# Altium project SuperBot.PrjPcb
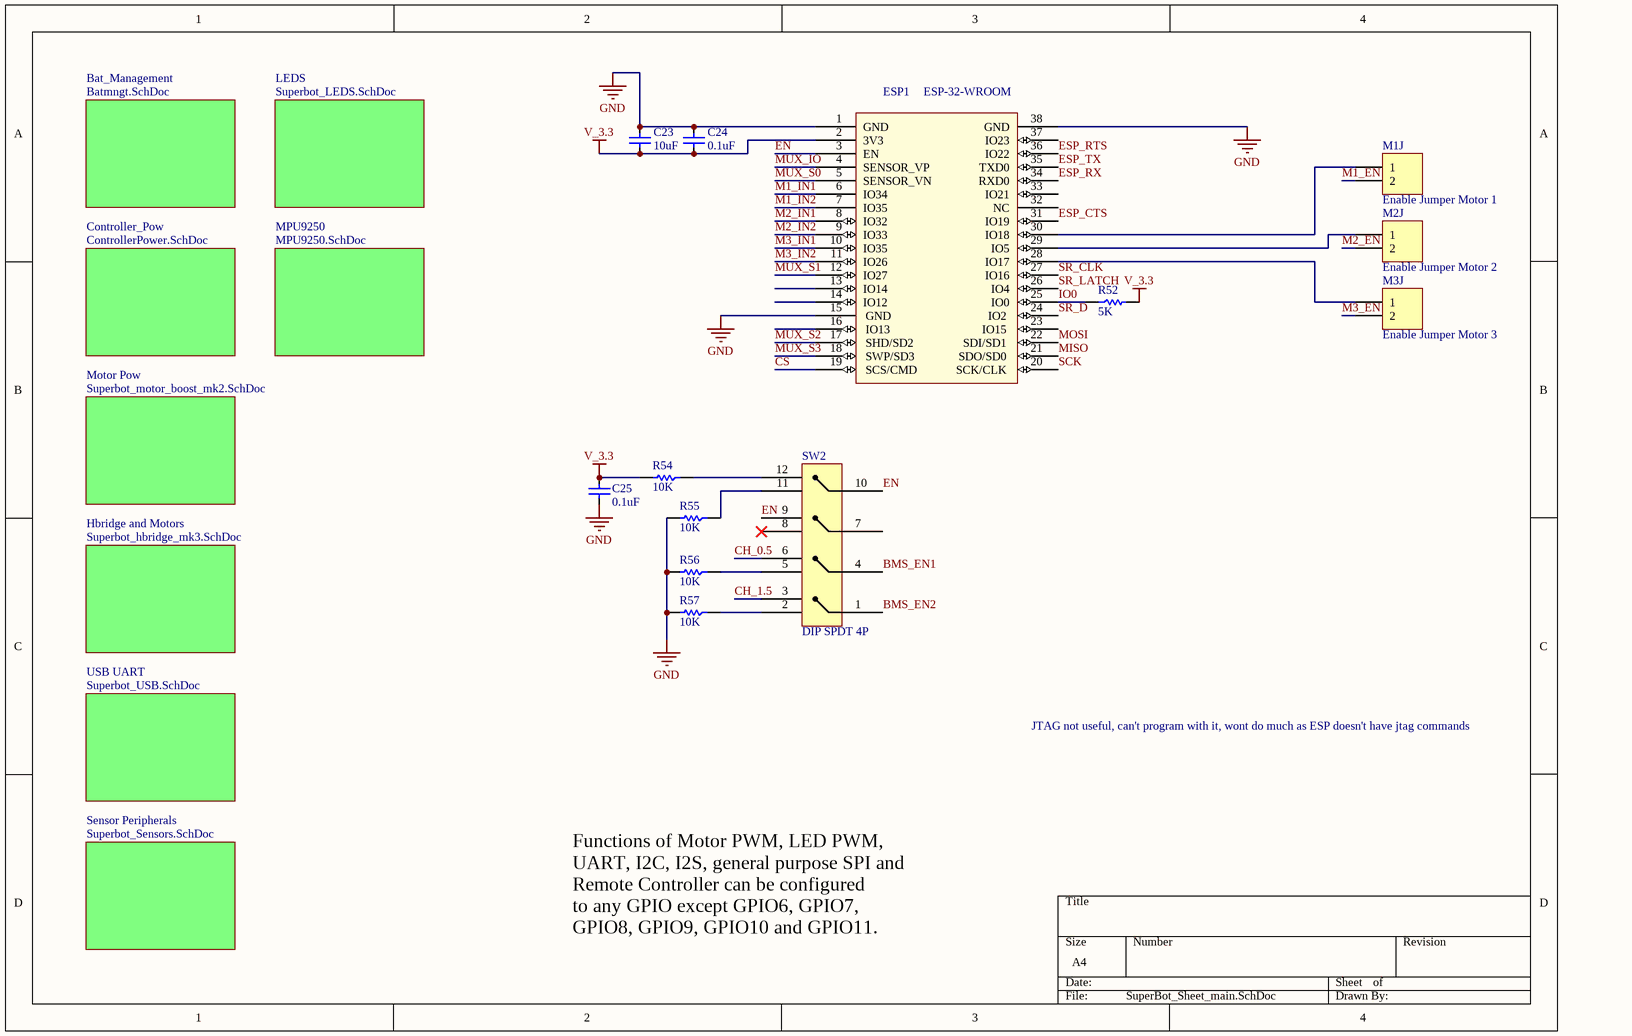
[diagram p0: SuperBot_Sheet_main.SchDoc]
9 sheets, 122 parts. Net scope: global (net labels, ports and power ports of the same name join across sheets).
Board file: SuperBot_Pcb.PcbDoc
Sheets:
  SuperBot_Sheet_main.SchDoc
    Bat_Management = Batmngt.SchDoc
    Controller_Pow = ControllerPower.SchDoc
    Hbridge and Motors = Superbot_hbridge_mk3.SchDoc
    Motor Pow = Superbot_motor_boost_mk2.SchDoc
    USB UART = Superbot_USB.SchDoc
    Sensor Peripherals = SuperBot_Sensors.SchDoc
    LEDS = Superbot_LEDS.SchDoc
    MPU9250 = MPU9250.SchDoc

## Sheet SuperBot_Sheet_main.SchDoc
size A4

### Parts
C23  10uF  [CAP0603R]
C24  0.1uF  [CAP0603R]
C25  0.1uF  [CAP0603R]
ESP1  ESP-32-WROOM  [ESP-32-WROOM]
M1J  Enable Jumper Motor 1  [HDR1X2]
M2J  Enable Jumper Motor 2  [HDR1X2]
M3J  Enable Jumper Motor 3  [HDR1X2]
R52  5K  [RES0603R]
R54  10K  [RES0603R]
R55  10K  [RES0603R]
R56  10K  [RES0603R]
R57  10K  [RES0603R]
SW2  DIP SPDT 4P  [DIP SPDT 4P]

### Sub-sheets
Bat_Management = Batmngt.SchDoc: no entries
Controller_Pow = ControllerPower.SchDoc: no entries
Hbridge and Motors = Superbot_hbridge_mk3.SchDoc: no entries
LEDS = Superbot_LEDS.SchDoc: no entries
Motor Pow = Superbot_motor_boost_mk2.SchDoc: no entries
MPU9250 = MPU9250.SchDoc: no entries
Sensor Peripherals = Superbot_Sensors.SchDoc: no entries
USB UART = Superbot_USB.SchDoc: no entries

### Nets
GND: C23.1 C24.1 C25.2 ESP1.1(GND) ESP1.15(GND) ESP1.38(GND) R55.2 R56.2 R57.2
V_3.3: C23.2 C24.2 C25.1 ESP1.2(3V3) R52.2 R54.2
BMS_EN1: SW2.4
BMS_EN2: SW2.1
CH_0.5: SW2.6
CH_1.5: SW2.3
CS: ESP1.19(SCS/CMD)
EN: ESP1.3(EN) SW2.9 SW2.10
ESP_CTS: ESP1.31(IO19)
ESP_RTS: ESP1.36(IO22)
ESP_RX: ESP1.34(RXD0)
ESP_TX: ESP1.35(TXD0)
IO0: ESP1.25(IO0) R52.1
M1_EN: M1J.2
M1_IN1: ESP1.6(IO34)
M1_IN2: ESP1.7(IO35)
M2_EN: M2J.2
M2_IN1: ESP1.8(IO32)
M2_IN2: ESP1.9(IO33)
M3_EN: M3J.2
M3_IN1: ESP1.10(IO35)
M3_IN2: ESP1.11(IO26)
MISO: ESP1.21(SDO/SD0)
MOSI: ESP1.22(SDI/SD1)
MUX_IO: ESP1.4(SENSOR_VP)
MUX_S0: ESP1.5(SENSOR_VN)
MUX_S1: ESP1.12(IO27)
MUX_S2: ESP1.17(SHD/SD2)
MUX_S3: ESP1.18(SWP/SD3)
SCK: ESP1.20(SCK/CLK)
SR_CLK: ESP1.27(IO16)
SR_D: ESP1.24(IO2)
SR_LATCH: ESP1.26(IO4)
NetESP1_28: ESP1.28(IO17) M3J.1
NetESP1_29: ESP1.29(IO5) M2J.1
NetESP1_30: ESP1.30(IO18) M1J.1
NetR54_1: R54.1 SW2.12
NetR55_1: R55.1 SW2.11
NetR56_1: R56.1 SW2.5
NetR57_1: R57.1 SW2.2

Not connected (* = marked no-connect by the designer): ESP1 13(IO14) 14(IO12) 16(IO13) 23(IO15) 32(NC) 33(IO21) 37(IO23); SW2 7 8*

### Notes on the sheet
- JTAG not useful, can't program with it, wont do much as ESP doesn't have jtag commands
- Functions of Motor PWM, LED PWM, UART, I2C, I2S, general purpose SPI and Remote Controller can be configured
  to any GPIO except GPIO6, GPIO7, GPIO8, GPIO9, GPIO10 and GPIO11.

### Library data of the parts
C23-C25 = C: Capacitor; Manufacturer: Microchip Technology; Manufacturer Part Num: MIC5378YC5-TR; Class I: Passive; Revision: July-2002: Re-released for DXP Platform.; Supplier 1: Digikey; Supplier Part Number 1: *; Supplier Part Number 1: 1611-MIC5378YC5-CT-ND
  C23: Value: 10uF
  C24 C25: Value: 0.1uF
ESP1 = ESP-32-WROOM: ESP-32-WROOM, WIFI + BT
M1J M2J M3J = Header 2: Header, 2-Pin; LatestRevisionDate: 17-Jul-2002; LatestRevisionNote: Re-released for DXP Platform.; Publisher: Altium Limited
R52 R54-R57 = R: Resistor; Supplier 1: Digikey; Supplier Part Number 1: *
  R52: Value: 5K
  R54-R57: Value: 10K

## Sheet Batmngt.SchDoc
size A4
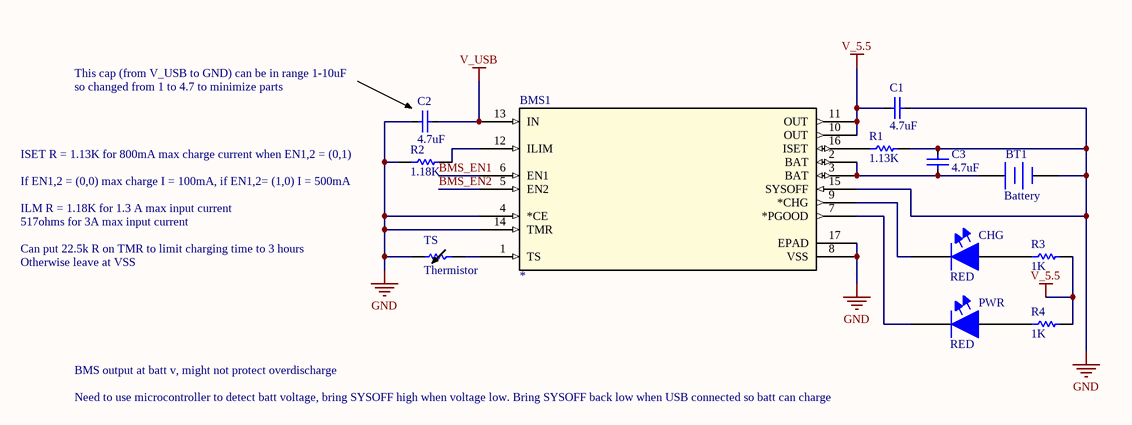
[diagram p1: Batmngt.SchDoc]

### Parts
BMS1  *  [RGT16_1P7X1P7]
BT1  Battery  [BAT-2]
C1  4.7uF  [CAP0603R]
C2  4.7uF  [CAP0603R]
C3  4.7uF  [CAP0603R]
CHG  RED  [0603_LED]
PWR  RED  [0603_LED]
R1  1.13K  [RES0603R]
R2  1.18K  [RES0603R]
R3  1K  [RES0603R]
R4  1K  [RES0603R]
TS  Thermistor  [RES0603R]

### Nets
GND: BMS1.4(*CE) BMS1.8(VSS) BMS1.14(TMR) BMS1.15(SYSOFF) BMS1.17(EPAD) BT1.2(-) C1.2 C2.1 C3.1 R1.2 R2.1 TS.2
V_5.5: BMS1.10(OUT) BMS1.11(OUT) C1.1 R3.2 R4.2
V_USB: BMS1.13(IN) C2.2
BMS_EN1: BMS1.6(EN1)
BMS_EN2: BMS1.5(EN2)
NetBMS1_1: BMS1.1(TS) TS.1
NetBMS1_2: BMS1.2(BAT) BMS1.3(BAT) BT1.1(+) C3.2
NetBMS1_7: BMS1.7(*PGOOD) PWR.K(CATHODE)
NetBMS1_9: BMS1.9(*CHG) CHG.K(CATHODE)
NetBMS1_12: BMS1.12(ILIM) R2.2
NetBMS1_16: BMS1.16(ISET) R1.1
NetCHG_A: CHG.A(ANODE) R3.1
NetPWR_A: PWR.A(ANODE) R4.1

### Notes on the sheet
- (near C2) This cap (from V_USB to GND) can be in range 1-10uF
- so changed from 1 to 4.7 to minimize parts
- (near R2) ISET R = 1.13K for 800mA max charge current when EN1,2 = (0,1)
- (near R2) If EN1,2 = (0,0) max charge I = 100mA, if EN1,2= (1,0) I = 500mA
- ILM R = 1.18K for 1.3 A max input current
- Can put 22.5k R on TMR to limit charging time to 3 hours
- Otherwise leave at VSS
- 517ohms for 3A max input current
- BMS output at batt v, might not protect overdischarge
- Need to use microcontroller to detect batt voltage, bring SYSOFF high when voltage low. Bring SYSOFF back low when USB connected so batt can charge

### Library data of the parts
BMS1 = BQ24079RGTR: Imported; Manufacturer: Texas Instruments; Built_By: EMA_UL_Team; C: Copyright (C) 2015 Accelerated Designs. All rights reserved; Vendor: Vendor; Manufacturer_Part_Number: BQ24079RGTR; Value: Value; Type: Type; RefDes: RefDes
BT1 = Battery: Multicell Battery; Published: 24-Mar-1999; LatestRevisionDate: 17-Jul-2002; LatestRevisionNote: Re-released for DXP Platform.; PackageReference: BAT-2; Publisher: Altium Limited; PackageDescription: Battery; 2 Leads
C1-C3 = C: as C23 on sheet SuperBot_Sheet_main; Revision: July-2002: Re-released for DXP Platform.; Supplier 1: Digikey; Supplier Part Number 1: *; Supplier Part Number 1: 1611-MIC5378YC5-CT-ND; Value: 4.7uF
CHG PWR = LED: Color: RED; Supplier 1: Digikey
R1-R4 = R: Resistor; Supplier 1: Digikey; Supplier Part Number 1: *
  R1: Value: 1.13K
  R2: Value: 1.18K
  R3 R4: Value: 1K

## Sheet ControllerPower.SchDoc
size A4
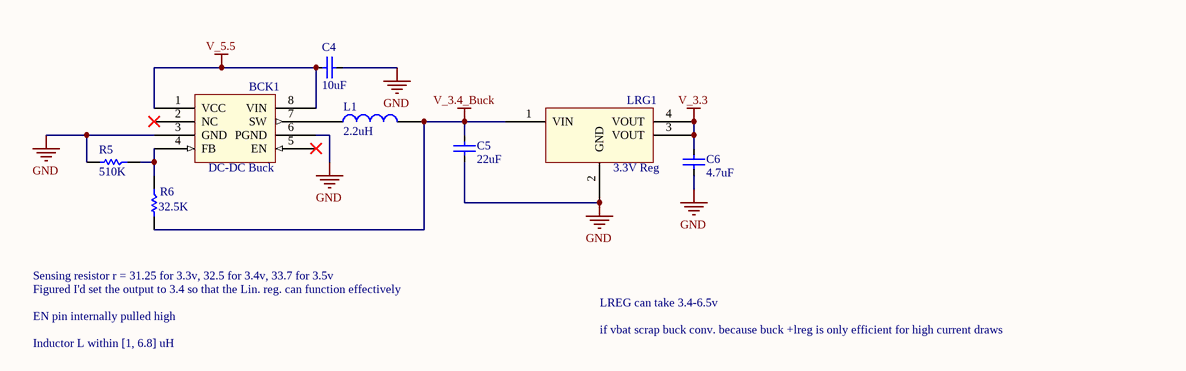
[diagram p2: ControllerPower.SchDoc]

### Parts
BCK1  DC-DC Buck  [SOP8_AP3435]
C4  10uF  [CAP0603R]
C5  22uF  [CAP0805R]
C6  4.7uF  [CAP0603R]
L1  2.2uH  [744031004]
LRG1  3.3V Reg  [SOT223_AP2114]
R5  510K  [RES0603R]
R6  32.5K  [RES0603R]

### Nets
GND: BCK1.3(GND) BCK1.6(PGND) C4.1 C5.2 C6.2 LRG1.2(GND) R5.2
V_3.3: C6.1 LRG1.3(VOUT) LRG1.4(VOUT)
V_3.4_Buck: C5.1 L1.2 LRG1.1(VIN) R6.2
V_5.5: BCK1.1(VCC) BCK1.8(VIN) C4.2
NetBCK1_4: BCK1.4(FB) R5.1 R6.1
NetBCK1_7: BCK1.7(SW) L1.1

Not connected (* = marked no-connect by the designer): BCK1 2(NC)* 5(EN)*

### Notes on the sheet
- Sensing resistor r = 31.25 for 3.3v, 32.5 for 3.4v, 33.7 for 3.5v
- Inductor L within [1, 6.8] uH
- Figured I'd set the output to 3.4 so that the Lin. reg. can function effectively
- EN pin internally pulled high
- if vbat scrap buck conv. because buck +lreg is only efficient for high current draws
- LREG can take 3.4-6.5v

### Library data of the parts
BCK1 = DC-DC Buck: AP3435, 1.0MHz, 3.5A, Synchronous Step Down DC-DC Converter; Manufacturer: Diodes Inc; Manufacturer Part Num: AP3435MPTR-G1; Supplier 1: Digikey; Supplier Part Number 1: AP3435MPTR-G1DICT-ND
C4-C6 = C: as C23 on sheet SuperBot_Sheet_main; Revision: July-2002: Re-released for DXP Platform.; Supplier 1: Digikey; Supplier Part Number 1: *; Supplier Part Number 1: 1611-MIC5378YC5-CT-ND
  C4: Value: 10uF
  C5: Value: 22uF
  C6: Value: 4.7uF
L1 = L: Inductor; Value: 1uH; Supplier 1: Digikey; Supplier Part Number 1: *
LRG1 = Reg 3.3V: AP2114H-3.3TRG1; Manufacturer: Diodes Inc; Value: Value; Manufacturer Part Num: AP2114H-3.3TRG1; Supplier 1: Digikey
R5 R6 = R: Resistor; Supplier 1: Digikey; Supplier Part Number 1: *
  R5: Value: 510K
  R6: Value: 32.5K

## Sheet Superbot_hbridge_mk3.SchDoc
size A4
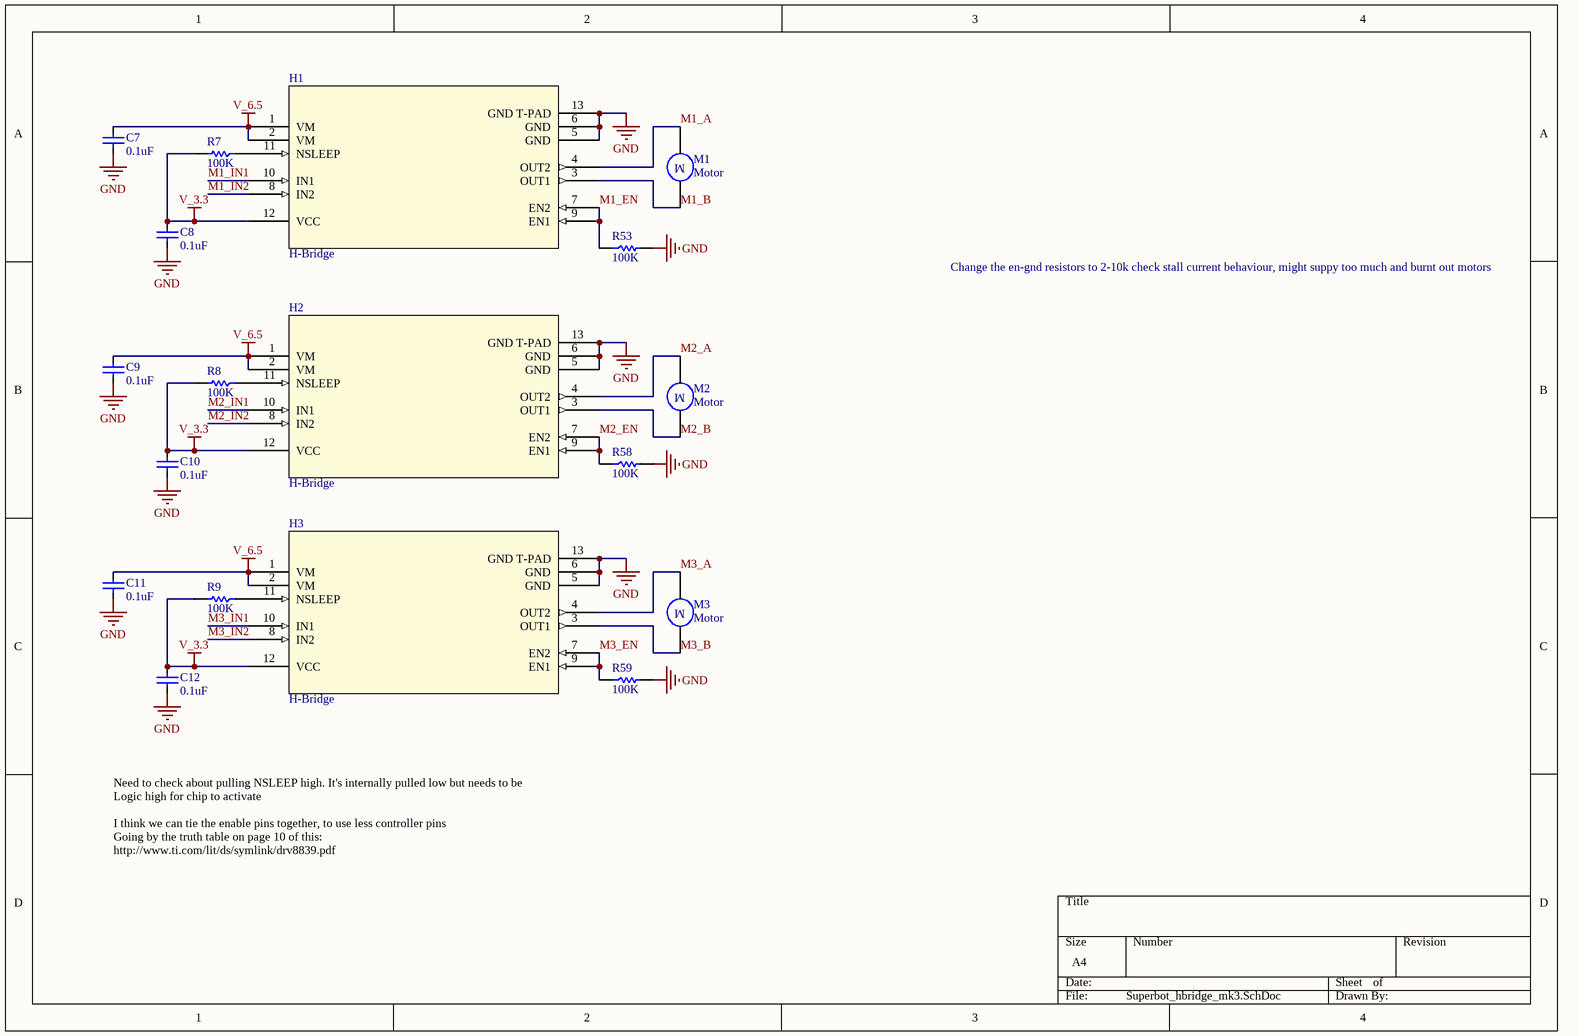
[diagram p3: Superbot_hbridge_mk3.SchDoc]

### Parts
C7  0.1uF  [CAP0603R]
C8  0.1uF  [CAP0603R]
C9  0.1uF  [CAP0603R]
C10  0.1uF  [CAP0603R]
C11  0.1uF  [CAP0603R]
C12  0.1uF  [CAP0603R]
H1  H-Bridge  [WSON_0.8mm_DSS0012A]
H2  H-Bridge  [WSON_0.8mm_DSS0012A]
H3  H-Bridge  [WSON_0.8mm_DSS0012A]
M1  Motor  [MicroMotor_TypeA]
M2  Motor  [MicroMotor_TypeA]
M3  Motor  [MicroMotor_TypeA]
R7  100K  [RES0603R]
R8  100K  [RES0603R]
R9  100K  [RES0603R]
R53  100K  [RES0603R]
R58  100K  [RES0603R]
R59  100K  [RES0603R]

### Nets
GND: C7.2 C8.2 C9.2 C10.2 C11.2 C12.2 H1.5(GND) H1.6(GND) H1.13(GND_T-PAD) H2.5(GND) H2.6(GND) H2.13(GND_T-PAD) H3.5(GND) H3.6(GND) H3.13(GND_T-PAD) R53.2 R58.2 R59.2
V_3.3: C8.1 C10.1 C12.1 H1.12(VCC) H2.12(VCC) H3.12(VCC) R7.2 R8.2 R9.2
V_6.5: C7.1 C9.1 C11.1 H1.1(VM) H1.2(VM) H2.1(VM) H2.2(VM) H3.1(VM) H3.2(VM)
M1_A: H1.4(OUT2) M1.2
M1_B: H1.3(OUT1) M1.1
M1_EN: H1.7(EN2) H1.9(EN1) R53.1
M1_IN1: H1.10(IN1)
M1_IN2: H1.8(IN2)
M2_A: H2.4(OUT2) M2.2
M2_B: H2.3(OUT1) M2.1
M2_EN: H2.7(EN2) H2.9(EN1) R58.1
M2_IN1: H2.10(IN1)
M2_IN2: H2.8(IN2)
M3_A: H3.4(OUT2) M3.2
M3_B: H3.3(OUT1) M3.1
M3_EN: H3.7(EN2) H3.9(EN1) R59.1
M3_IN1: H3.10(IN1)
M3_IN2: H3.8(IN2)
NetH1_11: H1.11(NSLEEP) R7.1
NetH2_11: H2.11(NSLEEP) R8.1
NetH3_11: H3.11(NSLEEP) R9.1

### Notes on the sheet
- Change the en-gnd resistors to 2-10k check stall current behaviour, might suppy too much and burnt out motors
- Need to check about pulling NSLEEP high. It's internally pulled low but needs to be Logic high for chip to activate
  I think we can tie the enable pins together, to use less controller pins
  Going by the truth table on page 10 of this: http://www.ti.com/lit/ds/symlink/drv8839.pdf
- (in symbol Motor) M

### Library data of the parts
C7-C12 = C: as C23 on sheet SuperBot_Sheet_main; Revision: July-2002: Re-released for DXP Platform.; Supplier 1: Digikey; Supplier Part Number 1: *; Supplier Part Number 1: 1611-MIC5378YC5-CT-ND; Value: 0.1uF
H1-H3 = DRV8839DSSR: 1.8A , Half Bridge (2), Driver - Fully Integrated, Control and Power Stage; Manufacturer: Texas Instruments; Class I: PIM; Value: Value; Manufacturer Part Num: DRV8839DSSR; Supplier 1: Digikey; Supplier Part Number 1: 296-35701-1-ND
R7-R9 R53 R58 R59 = R: Resistor; Supplier 1: Digikey; Supplier Part Number 1: *; Value: 100K

## Sheet Superbot_motor_boost_mk2.SchDoc
size A4
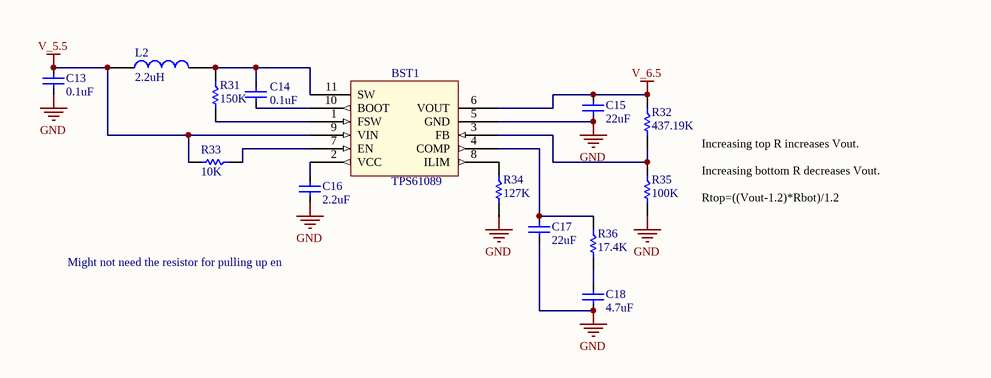
[diagram p4: Superbot_motor_boost_mk2.SchDoc]

### Parts
BST1  TPS61089  [VQFN_RNR0011A_1mm]
C13  0.1uF  [CAP0603R]
C14  0.1uF  [CAP0603R]
C15  22uF  [CAP0805R]
C16  2.2uF  [CAP0603R]
C17  22uF  [CAP0805R]
C18  4.7uF  [CAP0603R]
L2  2.2uH  [744031004]
R31  150K  [RES0603R]
R32  437.19K  [RES0603R]
R33  10K  [RES0603R]
R34  127K  [RES0603R]
R35  100K  [RES0603R]
R36  17.4K  [RES0603R]

### Nets
GND: BST1.5(GND) C13.2 C15.2 C16.2 C17.2 C18.2 R34.2 R35.2
V_5.5: BST1.9(VIN) C13.1 L2.1 R33.2
V_6.5: BST1.6(VOUT) C15.1 R32.1
NetBST1_1: BST1.1(FSW) R31.2
NetBST1_2: BST1.2(VCC) C16.1
NetBST1_3: BST1.3(FB) R32.2 R35.1
NetBST1_4: BST1.4(COMP) C17.1 R36.1
NetBST1_7: BST1.7(EN) R33.1
NetBST1_8: BST1.8(ILIM) R34.1
NetBST1_10: BST1.10(BOOT) C14.2
NetBST1_11: BST1.11(SW) C14.1 L2.2 R31.1
NetC18_1: C18.1 R36.2

### Notes on the sheet
- Might not need the resistor for pulling up en
- Increasing top R increases Vout.
  Increasing bottom R decreases Vout.
  Rtop=((Vout-1.2)*Rbot)/1.2

### Library data of the parts
BST1 = TPS61089: Boost Switching Regulator IC Positive Adjustable 4.5V 1 Output 7A 11-VFQFN; Manufacturer: Texas Instruments; Manufacturer Part Num: TPS61089RNRT; Class I: PMIC; Supplier 1: Digikey; Supplier Part Number 1: 296-46242-1-ND
C13-C18 = C: as C23 on sheet SuperBot_Sheet_main; Revision: July-2002: Re-released for DXP Platform.; Supplier 1: Digikey; Supplier Part Number 1: *; Supplier Part Number 1: 1611-MIC5378YC5-CT-ND
  C13 C14: Value: 0.1uF
  C15 C17: Value: 22uF
  C16: Value: 2.2uF
  C18: Value: 4.7uF
L2 = L: Inductor; Value: 1uH; Supplier 1: Digikey; Supplier Part Number 1: *
R31-R36 = R: Resistor; Supplier 1: Digikey; Supplier Part Number 1: *
  R31: Value: 150K
  R32: Value: 437.19K
  R33: Value: 10K
  R34: Value: 127K
  R35: Value: 100K
  R36: Value: 17.4K

## Sheet Superbot_USB.SchDoc
size A4
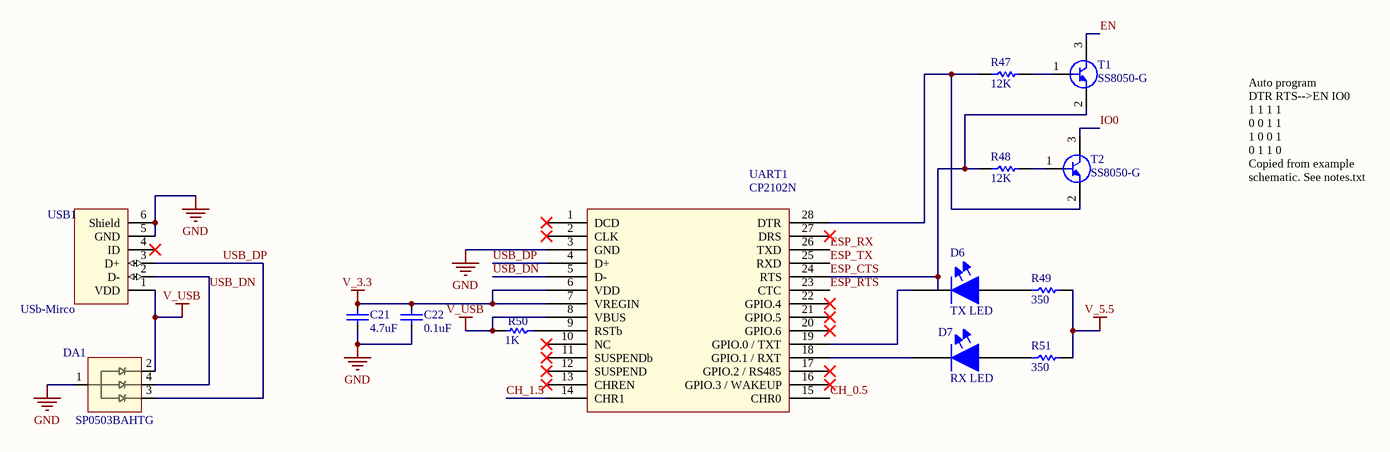
[diagram p5: Superbot_USB.SchDoc]

### Parts
C21  4.7uF  [CAP0603R]
C22  0.1uF  [CAP0603R]
D6  TX LED  [0603_LED]
D7  RX LED  [0603_LED]
DA1  SP0503BAHTG  [SOT143_SP0503BAHT]
R47  12K  [RES0603R]
R48  12K  [RES0603R]
R49  350  [RES0603R]
R50  1K  [RES0603R]
R51  350  [RES0603R]
T1  SS8050-G  [SOT23-SS8050-G]
T2  SS8050-G  [SOT23-SS8050-G]
UART1  CP2102N  [QFN28_CP2102n]
USB1  USb-Mirco  [USB_micro_through]

### Nets
GND: C21.2 C22.2 DA1.1(GND) UART1.3(GND) USB1.5(GND) USB1.6(Shield)
V_3.3: C21.1 C22.1 UART1.6(VDD) UART1.7(VREGIN)
V_5.5: R49.2 R51.2
V_USB: DA1.2(A) R50.2 UART1.8(VBUS) USB1.1(VDD)
CH_0.5: UART1.15(CHR0)
CH_1.5: UART1.14(CHR1)
EN: T1.3(CLCTR)
ESP_CTS: R48.1 T1.2(EMTTR) UART1.24(RTS)
ESP_RTS: UART1.23(CTC)
ESP_RX: UART1.26(TXD)
ESP_TX: UART1.25(RXD)
IO0: T2.3(CLCTR)
USB_DN: DA1.4(C) UART1.5(D-) USB1.2(D-)
USB_DP: DA1.3(B) UART1.4(D+) USB1.3(D+)
NetD6_A: D6.A(ANODE) R49.1
NetD6_K: D6.K(CATHODE) UART1.19(GPIO.0_/_TXT)
NetD7_A: D7.A(ANODE) R51.1
NetD7_K: D7.K(CATHODE) UART1.18(GPIO.1_/_RXT)
NetR47_1: R47.1 T2.2(EMTTR) UART1.28(DTR)
NetR47_2: R47.2 T1.1(BASE)
NetR48_2: R48.2 T2.1(BASE)
NetR50_1: R50.1 UART1.9(RSTb)

Not connected (* = marked no-connect by the designer): UART1 1(DCD)* 2(CLK)* 10(NC)* 11(SUSPENDb)* 12(SUSPEND)* 13(CHREN)* 16(GPIO.3_/_WAKEUP)* 17(GPIO.2_/_RS485)* 20(GPIO.6)* 21(GPIO.5)* 22(GPIO.4)* 27(DRS)*; USB1 4(ID)*

### Notes on the sheet
- Auto program
  DTR RTS-->EN IO0
  1 1 1 1
  0 0 1 1
  1 0 0 1
  0 1 1 0
  Copied from example schematic. See notes.txt

### Library data of the parts
C21 C22 = C: as C23 on sheet SuperBot_Sheet_main; Revision: July-2002: Re-released for DXP Platform.; Supplier 1: Digikey; Supplier Part Number 1: *; Supplier Part Number 1: 1611-MIC5378YC5-CT-ND
  C21: Value: 4.7uF
  C22: Value: 0.1uF
D6 D7 = LED: Color: RED; Supplier 1: Digikey
DA1 = SP0503BAHTG: TVS DIODE 5.5VWM 8.5VC SOT143; Manufacturer: Littelfuse; Value: *; Manufacturer Part Num: SP0503BAHTG; Supplier 1: Digikey; Supplier Part Number 1: F2715CT-ND
R47-R51 = R: Resistor; Supplier 1: Digikey; Supplier Part Number 1: *
  R47 R48: Value: 12K
  R49 R51: Value: 350
  R50: Value: 1K
T1 T2 = NPN Transistor
UART1 = CP2102N: 336-3694-ND / , IC BRIDGE USB TO UART 28QFN
USB1 = USb-Mirco: USb-Mirco, CONN RCPT MCR USB B SMD TH SHLL; Manufacturer Part Num: ZX62D-B-5P8; Manufacturer: Hirose; Value: *; Supplier 1: Digikey

## Sheet SuperBot_Sensors.SchDoc
size A4
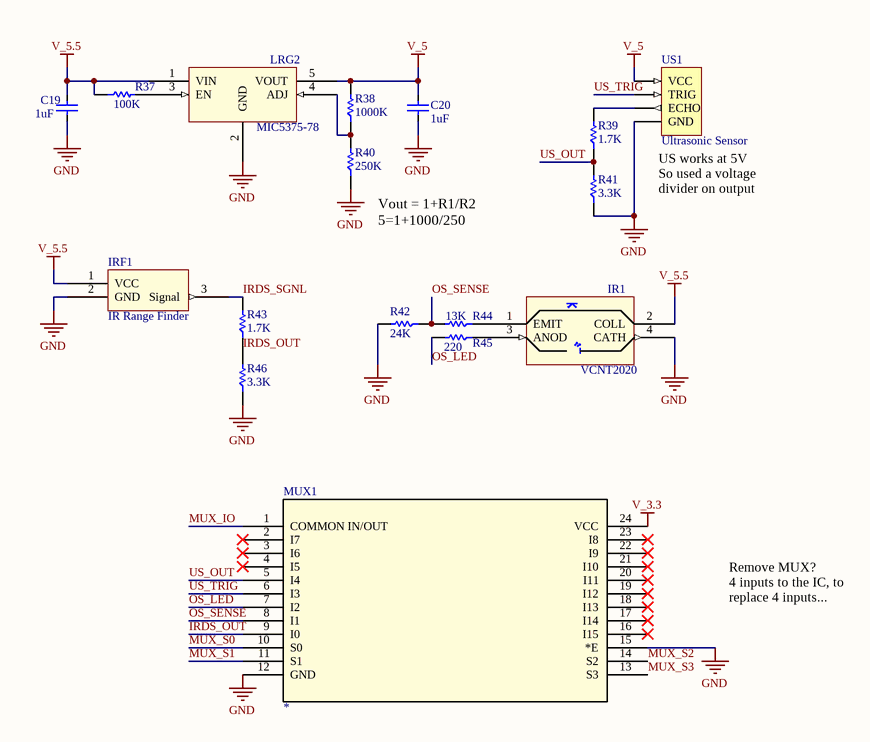
[diagram p6: SuperBot_Sensors.SchDoc]

### Parts
C19  1uF  [CAP0603R]
C20  1uF  [CAP0603R]
IR1  VCNT2020  [VCNT2020]
IRF1  IR Range Finder  [H3]
LRG2  MIC5375-78  [TSOP5_MIC537X]
MUX1  *  [DB24-M]
R37  100K  [RES0603R]
R38  1000K  [RES0603R]
R39  1.7K  [RES0603R]
R40  250K  [RES0603R]
R41  3.3K  [RES0603R]
R42  24K  [RES0603R]
R43  1.7K  [RES0603R]
R44  13K  [RES0603R]
R45  220  [RES0603R]
R46  3.3K  [RES0603R]
US1  Ultrasonic Sensor  [HDR1X4]

### Nets
GND: C19.2 C20.1 IR1.4(CATH) IRF1.2(GND) LRG2.2(GND) MUX1.12(GND) MUX1.15(*E) R40.1 R41.1 R42.2 R46.1 US1.4(GND)
V_3.3: MUX1.24(VCC)
V_5: C20.2 LRG2.5(VOUT) R38.2 US1.1(VCC)
V_5.5: C19.1 IR1.2(COLL) IRF1.1(VCC) LRG2.1(VIN) R37.1
IRDS_OUT: MUX1.9(I0) R43.1 R46.2
IRDS_SGNL: IRF1.3(Signal) R43.2
MUX_IO: MUX1.1(COMMON_IN/OUT)
MUX_S0: MUX1.10(S0)
MUX_S1: MUX1.11(S1)
MUX_S2: MUX1.14(S2)
MUX_S3: MUX1.13(S3)
OS_LED: MUX1.7(I2) R45.2
OS_SENSE: MUX1.8(I1) R42.1 R44.2
US_OUT: MUX1.5(I4) R39.1 R41.2
US_TRIG: MUX1.6(I3) US1.2(TRIG)
NetIR1_1: IR1.1(EMIT) R44.1
NetIR1_3: IR1.3(ANOD) R45.1
NetLRG2_3: LRG2.3(EN) R37.2
NetLRG2_4: LRG2.4(ADJ) R38.1 R40.2
NetR39_2: R39.2 US1.3(ECHO)

Not connected (* = marked no-connect by the designer): MUX1 2(I7)* 3(I6)* 4(I5)* 16(I15)* 17(I14)* 18(I13)* 19(I12)* 20(I11)* 21(I10)* 22(I9)* 23(I8)*

### Notes on the sheet
- (near US1) US works at 5V
  So used a voltage divider on output
- (near R40) Vout = 1+R1/R2
  5=1+1000/250
- Remove MUX?
  4 inputs to the IC, to replace 4 inputs...

### Library data of the parts
C19 C20 = C: as C23 on sheet SuperBot_Sheet_main; Revision: July-2002: Re-released for DXP Platform.; Supplier 1: Digikey; Supplier Part Number 1: *; Supplier Part Number 1: 1611-MIC5378YC5-CT-ND; Value: 1uF
IR1 = VCNT2020: Reflective Optical Sensor with Transistor Output; Manufacturer: Vishay Semiconductor; Class I: Sensor; Manufacturer Part Num: VCNT2020; Supplier 1: Digikey; Supplier Part Number 1: VCNT2020CT-ND
IRF1 = IR-Range-Finder: Sharp IR GP2Y0A21YK0F; Supplier 1: Digikey
LRG2 = MIC5378YC5: Linear Voltage Regulator IC Positive Adjustable 1 Output 1.5 V ~ 4.5 V 150mA SC-70-5; Manufacturer: Microchip Technology; Manufacturer Part Num: MIC5378YC5-TR; Supplier 1: Digikey; Supplier Part Number 1: 1611-MIC5378YC5-CT-ND
MUX1 = CD74HC4067SM96: Imported; Vendor: Texas Instruments; Built_By: EMA_UL_Team; C: Copyright (C) 2015 Accelerated Designs. All rights reserved; Manufacturer_Part_Number: CD74HC4067SM96; Value: Value; Type: Type; RefDes: RefDes
R37-R46 = R: Resistor; Supplier 1: Digikey; Supplier Part Number 1: *
  R37: Value: 100K
  R38: Value: 1000K
  R39 R43: Value: 1.7K
  R40: Value: 250K
  R41 R46: Value: 3.3K
  R42: Value: 24K
  R44: Value: 13K
  R45: Value: 220
US1 = Header 4: Header, 4-Pin; LatestRevisionDate: 17-Jul-2002; LatestRevisionNote: Re-released for DXP Platform.; Publisher: Altium Limited

## Sheet Superbot_LEDS.SchDoc
size A4
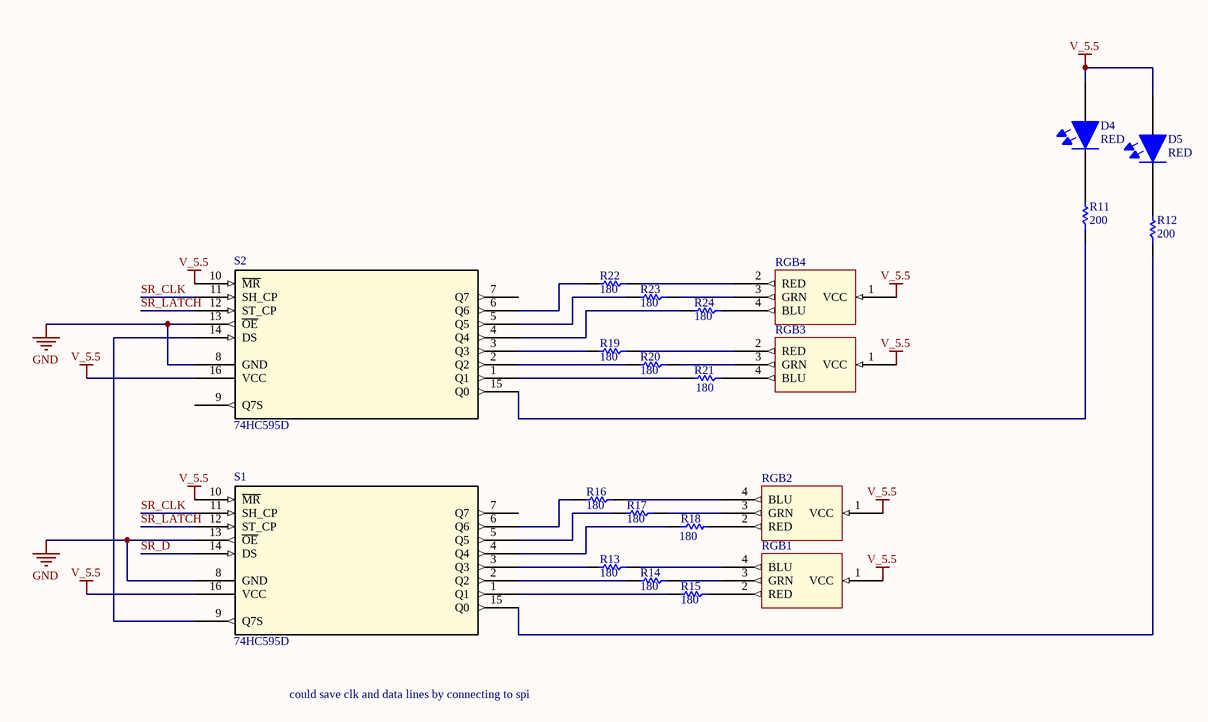
[diagram p7: Superbot_LEDS.SchDoc]

### Parts
D4  RED  [LED0603]
D5  RED  [LED0603]
R11  200  [RES0603R]
R12  200  [RES0603R]
R13  180  [RES0603R]
R14  180  [RES0603R]
R15  180  [RES0603R]
R16  180  [RES0603R]
R17  180  [RES0603R]
R18  180  [RES0603R]
R19  180  [RES0603R]
R20  180  [RES0603R]
R21  180  [RES0603R]
R22  180  [RES0603R]
R23  180  [RES0603R]
R24  180  [RES0603R]
RGB1  (no value)  [RGB LED]
RGB2  (no value)  [RGB LED]
RGB3  (no value)  [RGB LED]
RGB4  (no value)  [RGB LED]
S1  74HC595D  [SOT109-1-M]
S2  74HC595D  [SOT109-1-M]

### Nets
GND: S1.8(GND) S1.13(~{OE}) S2.8(GND) S2.13(~{OE})
V_5.5: D4.A(ANODE) D5.A(ANODE) RGB1.1(VCC) RGB2.1(VCC) RGB3.1(VCC) RGB4.1(VCC) S1.10(~{MR}) S1.16(VCC) S2.10(~{MR}) S2.16(VCC)
SR_CLK: S1.11(SH_CP) S2.11(SH_CP)
SR_D: S1.14(DS)
SR_LATCH: S1.12(ST_CP) S2.12(ST_CP)
NetD4_K: D4.K(CATHODE) R11.2
NetD5_K: D5.K(CATHODE) R12.2
NetR11_1: R11.1 S2.15(Q0)
NetR12_1: R12.1 S1.15(Q0)
NetR13_1: R13.1 RGB1.4(BLU)
NetR13_2: R13.2 S1.3(Q3)
NetR14_1: R14.1 RGB1.3(GRN)
NetR14_2: R14.2 S1.2(Q2)
NetR15_1: R15.1 RGB1.2(RED)
NetR15_2: R15.2 S1.1(Q1)
NetR16_1: R16.1 RGB2.4(BLU)
NetR16_2: R16.2 S1.6(Q6)
NetR17_1: R17.1 RGB2.3(GRN)
NetR17_2: R17.2 S1.5(Q5)
NetR18_1: R18.1 S1.4(Q4)
NetR18_2: R18.2 RGB2.2(RED)
NetR19_1: R19.1 RGB3.2(RED)
NetR19_2: R19.2 S2.3(Q3)
NetR20_1: R20.1 RGB3.3(GRN)
NetR20_2: R20.2 S2.2(Q2)
NetR21_1: R21.1 RGB3.4(BLU)
NetR21_2: R21.2 S2.1(Q1)
NetR22_1: R22.1 RGB4.2(RED)
NetR22_2: R22.2 S2.6(Q6)
NetR23_1: R23.1 RGB4.3(GRN)
NetR23_2: R23.2 S2.5(Q5)
NetR24_1: R24.1 RGB4.4(BLU)
NetR24_2: R24.2 S2.4(Q4)
NetS1_9: S1.9(Q7S) S2.14(DS)

Not connected (* = marked no-connect by the designer): S1 7(Q7); S2 7(Q7) 9(Q7S)

### Notes on the sheet
- could save clk and data lines by connecting to spi

### Library data of the parts
D4 D5 = LED: Color: RED; Supplier 1: Digikey
R11-R24 = R: Resistor; Supplier 1: Digikey; Supplier Part Number 1: *
  R11 R12: Value: 200
  R13-R24: Value: 180
RGB1-RGB4 = RGB LED: Red, Green, Blue (RGB) 622nm Red, 528nm Green, 468nm Blue LED Indication - Discrete 2V Red, 3.1V Green, 3.1V Blue 4-PLCC; Manufacturer: Cree Inc; Manufacturer Part Num: CLV1L-FKB-CJMNQEGBB7673673; Supplier 1: Digikey; Supplier Part Number 1: CLV1L-FKB-CJMNQEGBB7673673CT-ND
S1 S2 = 74HC595D: Shift Register; Vendor: NXP; Built_By: EMA_UL_Team; C: Copyright (C) 2015 Accelerated Designs. All rights reserved; Manufacturer_Part_Number: 74HC595D; Value: Value; Type: Type; RefDes: RefDes

## Sheet MPU9250.SchDoc
size A4
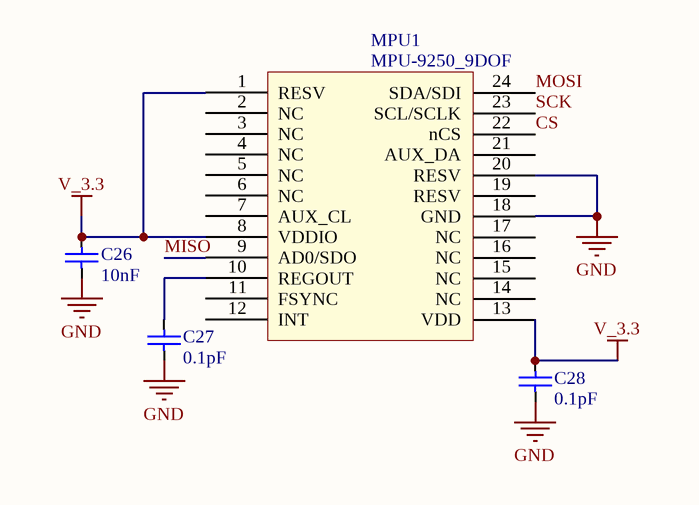
[diagram p8: MPU9250.SchDoc]

### Parts
C26  10nF  [CAP0603R]
C27  0.1pF  [CAP0603R]
C28  0.1pF  [CAP0603R]
MPU1  MPU-9250_9DOF  [QFN424_MPU-9250]

### Nets
GND: C26.2 C27.2 C28.2 MPU1.18(GND) MPU1.20(RESV)
V_3.3: C26.1 C28.1 MPU1.1(RESV) MPU1.8(VDDIO) MPU1.13(VDD)
CS: MPU1.22(nCS)
MISO: MPU1.9(AD0/SDO)
MOSI: MPU1.24(SDA/SDI)
SCK: MPU1.23(SCL/SCLK)
NetC27_1: C27.1 MPU1.10(REGOUT)

Not connected (* = marked no-connect by the designer): MPU1 2(NC) 3(NC) 4(NC) 5(NC) 6(NC) 7(AUX_CL) 11(FSYNC) 12(INT) 14(NC) 15(NC) 16(NC) 17(NC) 19(RESV) 21(AUX_DA)

### Library data of the parts
C26-C28 = C: as C23 on sheet SuperBot_Sheet_main; Revision: July-2002: Re-released for DXP Platform.; Supplier 1: Digikey; Supplier Part Number 1: *; Supplier Part Number 1: 1611-MIC5378YC5-CT-ND
  C26: Value: 10nF
  C27 C28: Value: 0.1pF
MPU1 = MPU-9250: IMU ACCEL/GYRO/MAG I2C/SPI 24QFN

## Nets that join several sheets
GND: SuperBot_Sheet_main (9 pins), Batmngt (12 pins), ControllerPower (7 pins), Superbot_hbridge_mk3 (18 pins), Superbot_motor_boost_mk2 (8 pins), Superbot_USB (6 pins), SuperBot_Sensors (12 pins), Superbot_LEDS (S1.8 S1.13 S2.8 S2.13), MPU9250 (5 pins)
V_3.3: SuperBot_Sheet_main (6 pins), ControllerPower (C6.1 LRG1.3 LRG1.4), Superbot_hbridge_mk3 (9 pins), Superbot_USB (C21.1 C22.1 UART1.6 UART1.7), SuperBot_Sensors (MUX1.24), MPU9250 (5 pins)
V_5.5: Batmngt (5 pins), ControllerPower (BCK1.1 BCK1.8 C4.2), Superbot_motor_boost_mk2 (BST1.9 C13.1 L2.1 R33.2), Superbot_USB (R49.2 R51.2), SuperBot_Sensors (5 pins), Superbot_LEDS (10 pins)
V_6.5: Superbot_hbridge_mk3 (9 pins), Superbot_motor_boost_mk2 (BST1.6 C15.1 R32.1)
V_USB: Batmngt (BMS1.13 C2.2), Superbot_USB (DA1.2 R50.2 UART1.8 USB1.1)
BMS_EN1: SuperBot_Sheet_main (SW2.4), Batmngt (BMS1.6)
BMS_EN2: SuperBot_Sheet_main (SW2.1), Batmngt (BMS1.5)
CH_0.5: SuperBot_Sheet_main (SW2.6), Superbot_USB (UART1.15)
CH_1.5: SuperBot_Sheet_main (SW2.3), Superbot_USB (UART1.14)
CS: SuperBot_Sheet_main (ESP1.19), MPU9250 (MPU1.22)
EN: SuperBot_Sheet_main (ESP1.3 SW2.9 SW2.10), Superbot_USB (T1.3)
ESP_CTS: SuperBot_Sheet_main (ESP1.31), Superbot_USB (R48.1 T1.2 UART1.24)
ESP_RTS: SuperBot_Sheet_main (ESP1.36), Superbot_USB (UART1.23)
ESP_RX: SuperBot_Sheet_main (ESP1.34), Superbot_USB (UART1.26)
ESP_TX: SuperBot_Sheet_main (ESP1.35), Superbot_USB (UART1.25)
IO0: SuperBot_Sheet_main (ESP1.25 R52.1), Superbot_USB (T2.3)
M1_EN: SuperBot_Sheet_main (M1J.2), Superbot_hbridge_mk3 (H1.7 H1.9 R53.1)
M1_IN1: SuperBot_Sheet_main (ESP1.6), Superbot_hbridge_mk3 (H1.10)
M1_IN2: SuperBot_Sheet_main (ESP1.7), Superbot_hbridge_mk3 (H1.8)
M2_EN: SuperBot_Sheet_main (M2J.2), Superbot_hbridge_mk3 (H2.7 H2.9 R58.1)
M2_IN1: SuperBot_Sheet_main (ESP1.8), Superbot_hbridge_mk3 (H2.10)
M2_IN2: SuperBot_Sheet_main (ESP1.9), Superbot_hbridge_mk3 (H2.8)
M3_EN: SuperBot_Sheet_main (M3J.2), Superbot_hbridge_mk3 (H3.7 H3.9 R59.1)
M3_IN1: SuperBot_Sheet_main (ESP1.10), Superbot_hbridge_mk3 (H3.10)
M3_IN2: SuperBot_Sheet_main (ESP1.11), Superbot_hbridge_mk3 (H3.8)
MISO: SuperBot_Sheet_main (ESP1.21), MPU9250 (MPU1.9)
MOSI: SuperBot_Sheet_main (ESP1.22), MPU9250 (MPU1.24)
MUX_IO: SuperBot_Sheet_main (ESP1.4), SuperBot_Sensors (MUX1.1)
MUX_S0: SuperBot_Sheet_main (ESP1.5), SuperBot_Sensors (MUX1.10)
MUX_S1: SuperBot_Sheet_main (ESP1.12), SuperBot_Sensors (MUX1.11)
MUX_S2: SuperBot_Sheet_main (ESP1.17), SuperBot_Sensors (MUX1.14)
MUX_S3: SuperBot_Sheet_main (ESP1.18), SuperBot_Sensors (MUX1.13)
SCK: SuperBot_Sheet_main (ESP1.20), MPU9250 (MPU1.23)
SR_CLK: SuperBot_Sheet_main (ESP1.27), Superbot_LEDS (S1.11 S2.11)
SR_D: SuperBot_Sheet_main (ESP1.24), Superbot_LEDS (S1.14)
SR_LATCH: SuperBot_Sheet_main (ESP1.26), Superbot_LEDS (S1.12 S2.12)